# EAGLE design S7G7_footprint_simplified_w_ethernet_v1p1 (EAGLE 9.3.1)
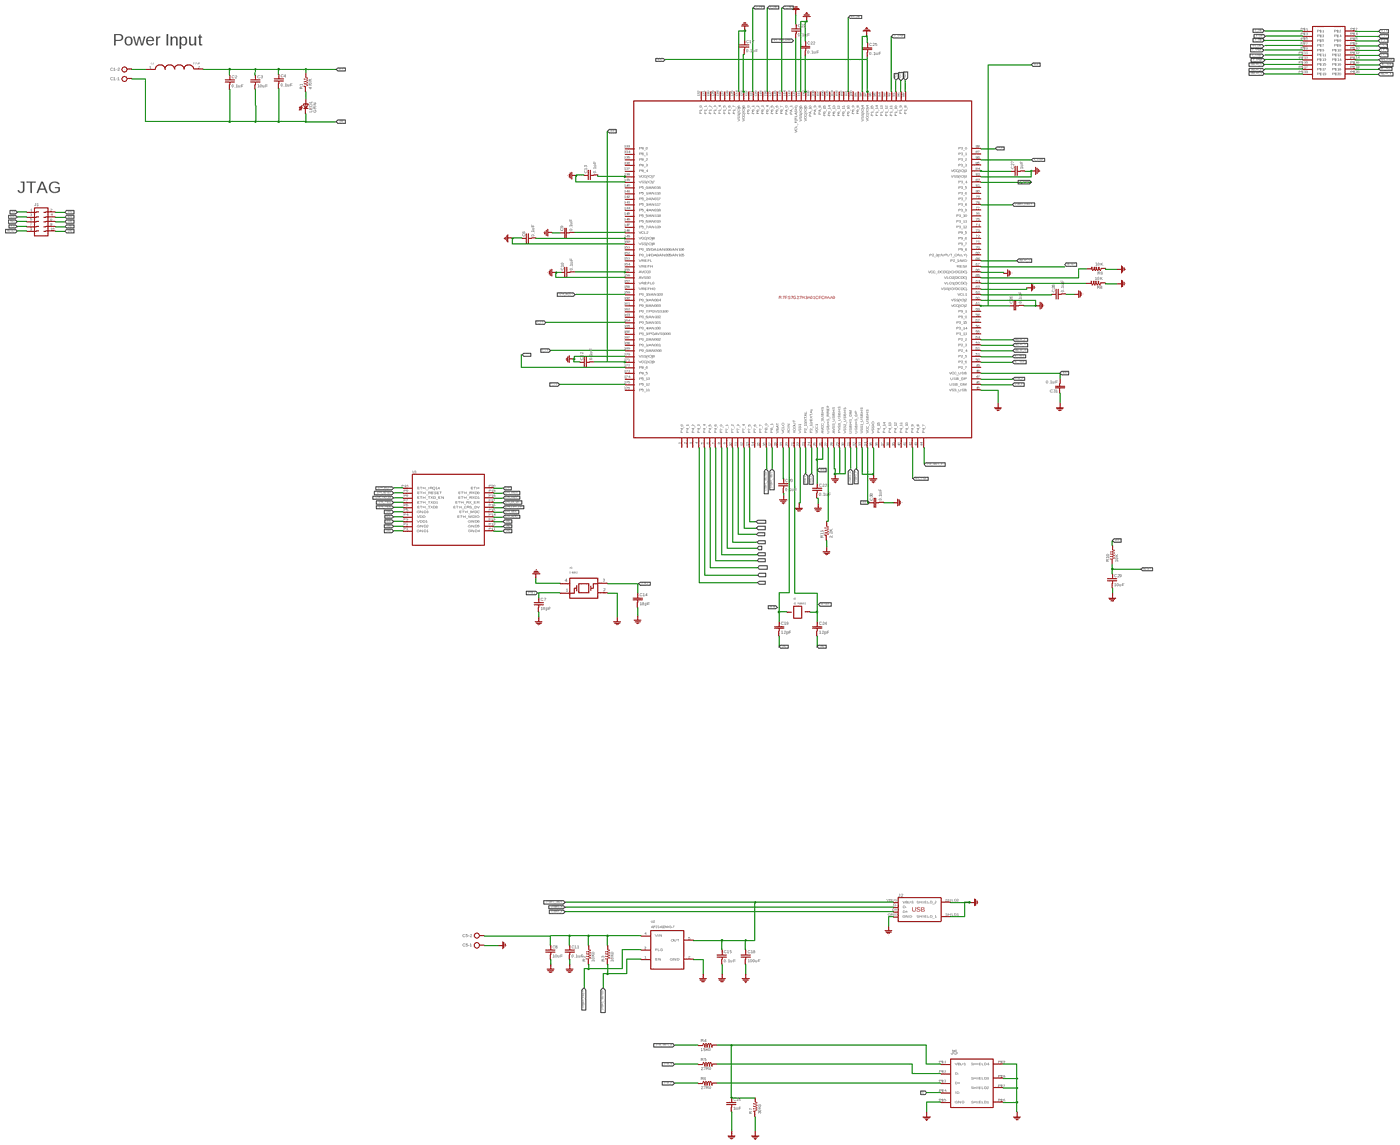
[diagram p0: schematic, sheet 1, overview]
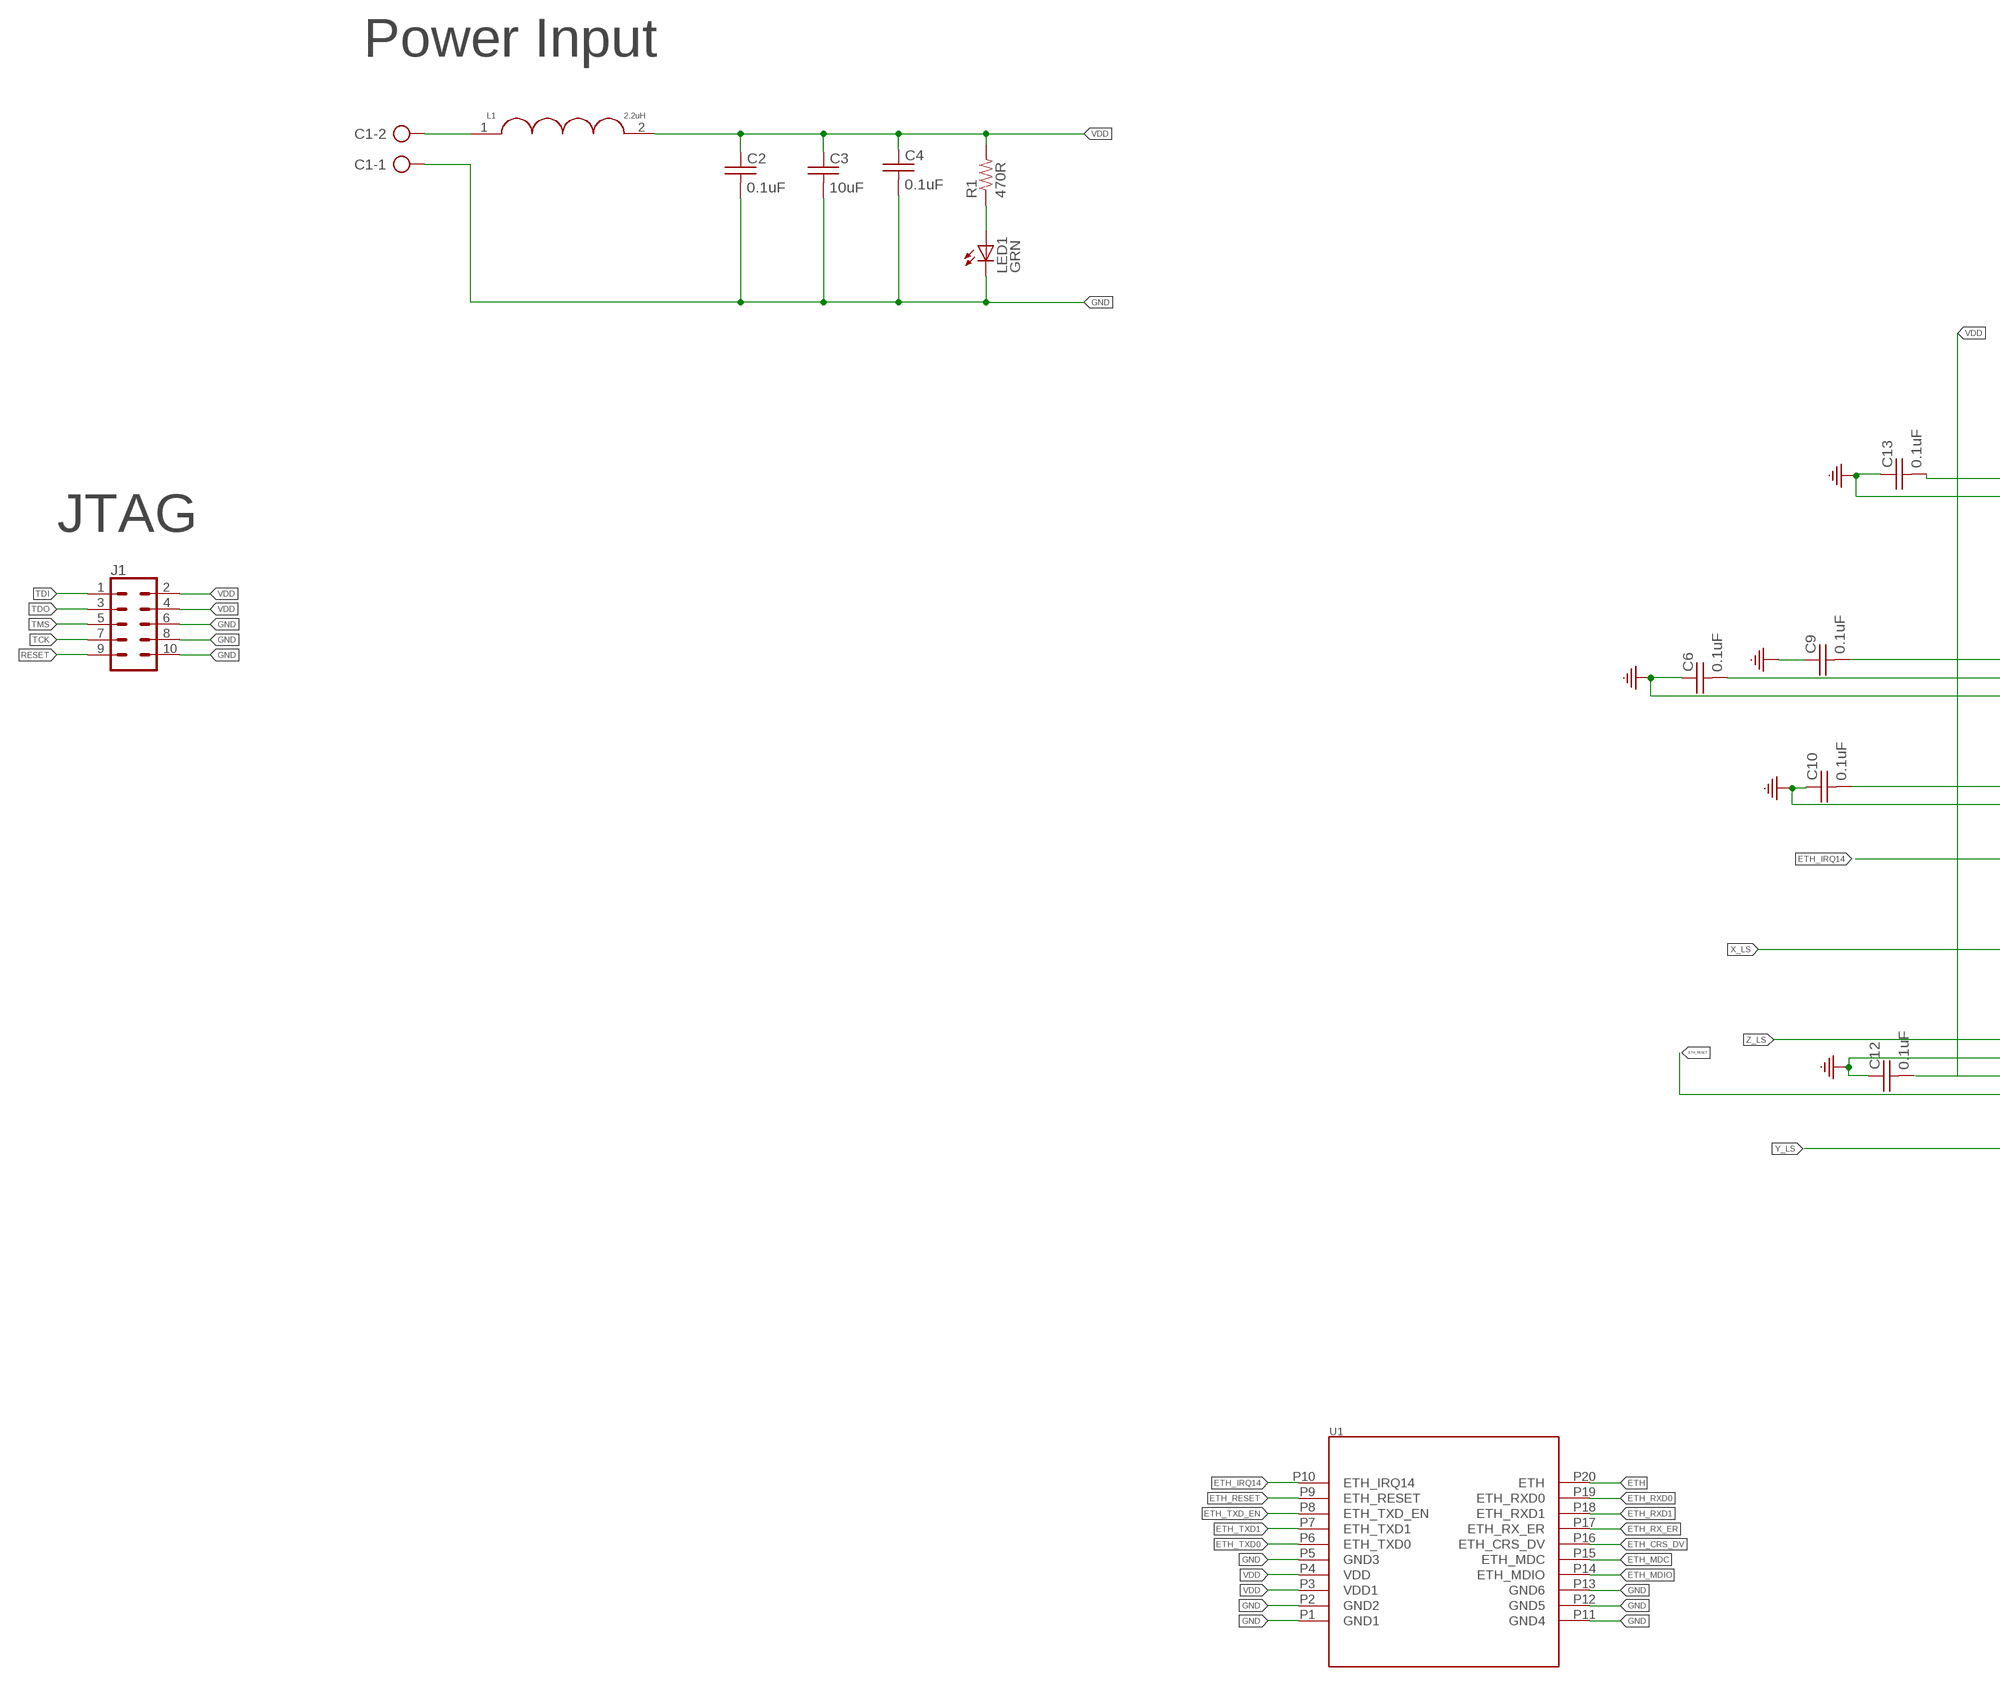
[diagram p1: schematic, sheet 1, part 1 of 4]
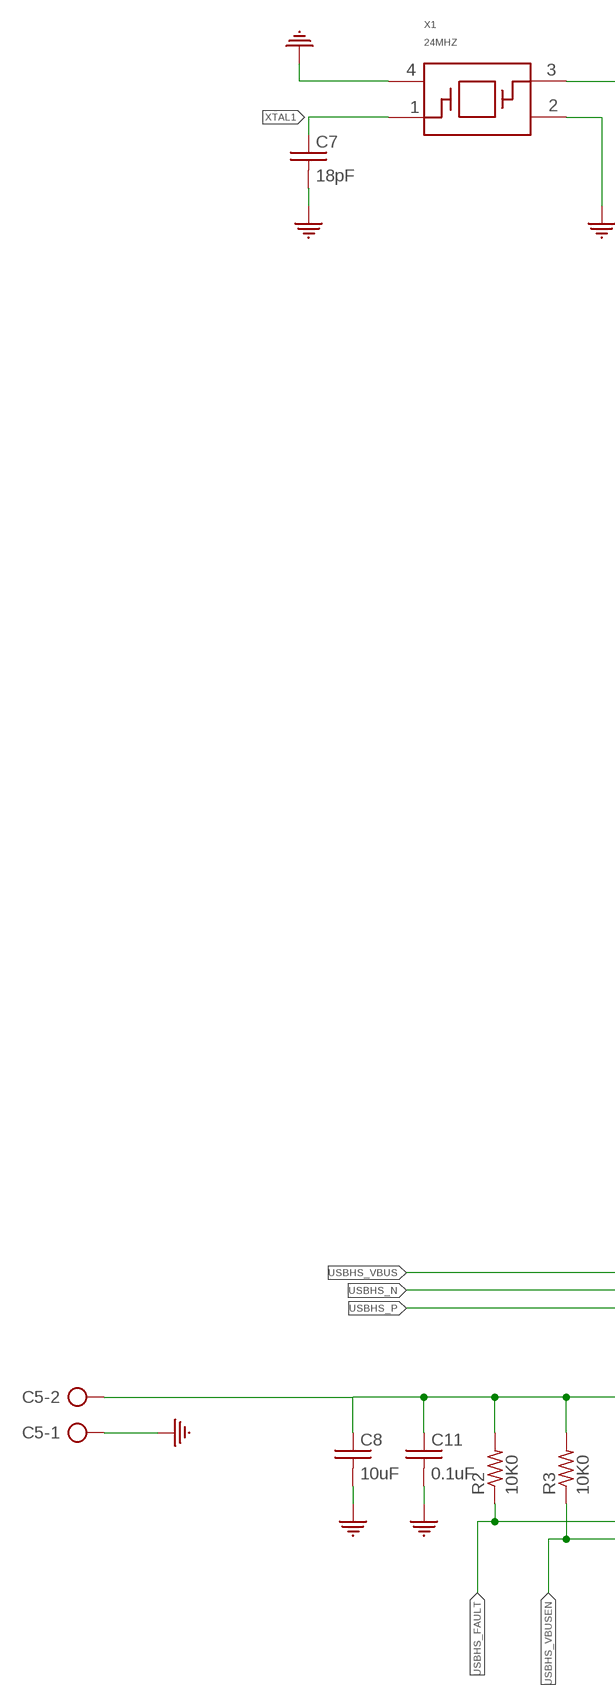
[diagram p2: schematic, sheet 1, part 2 of 4]
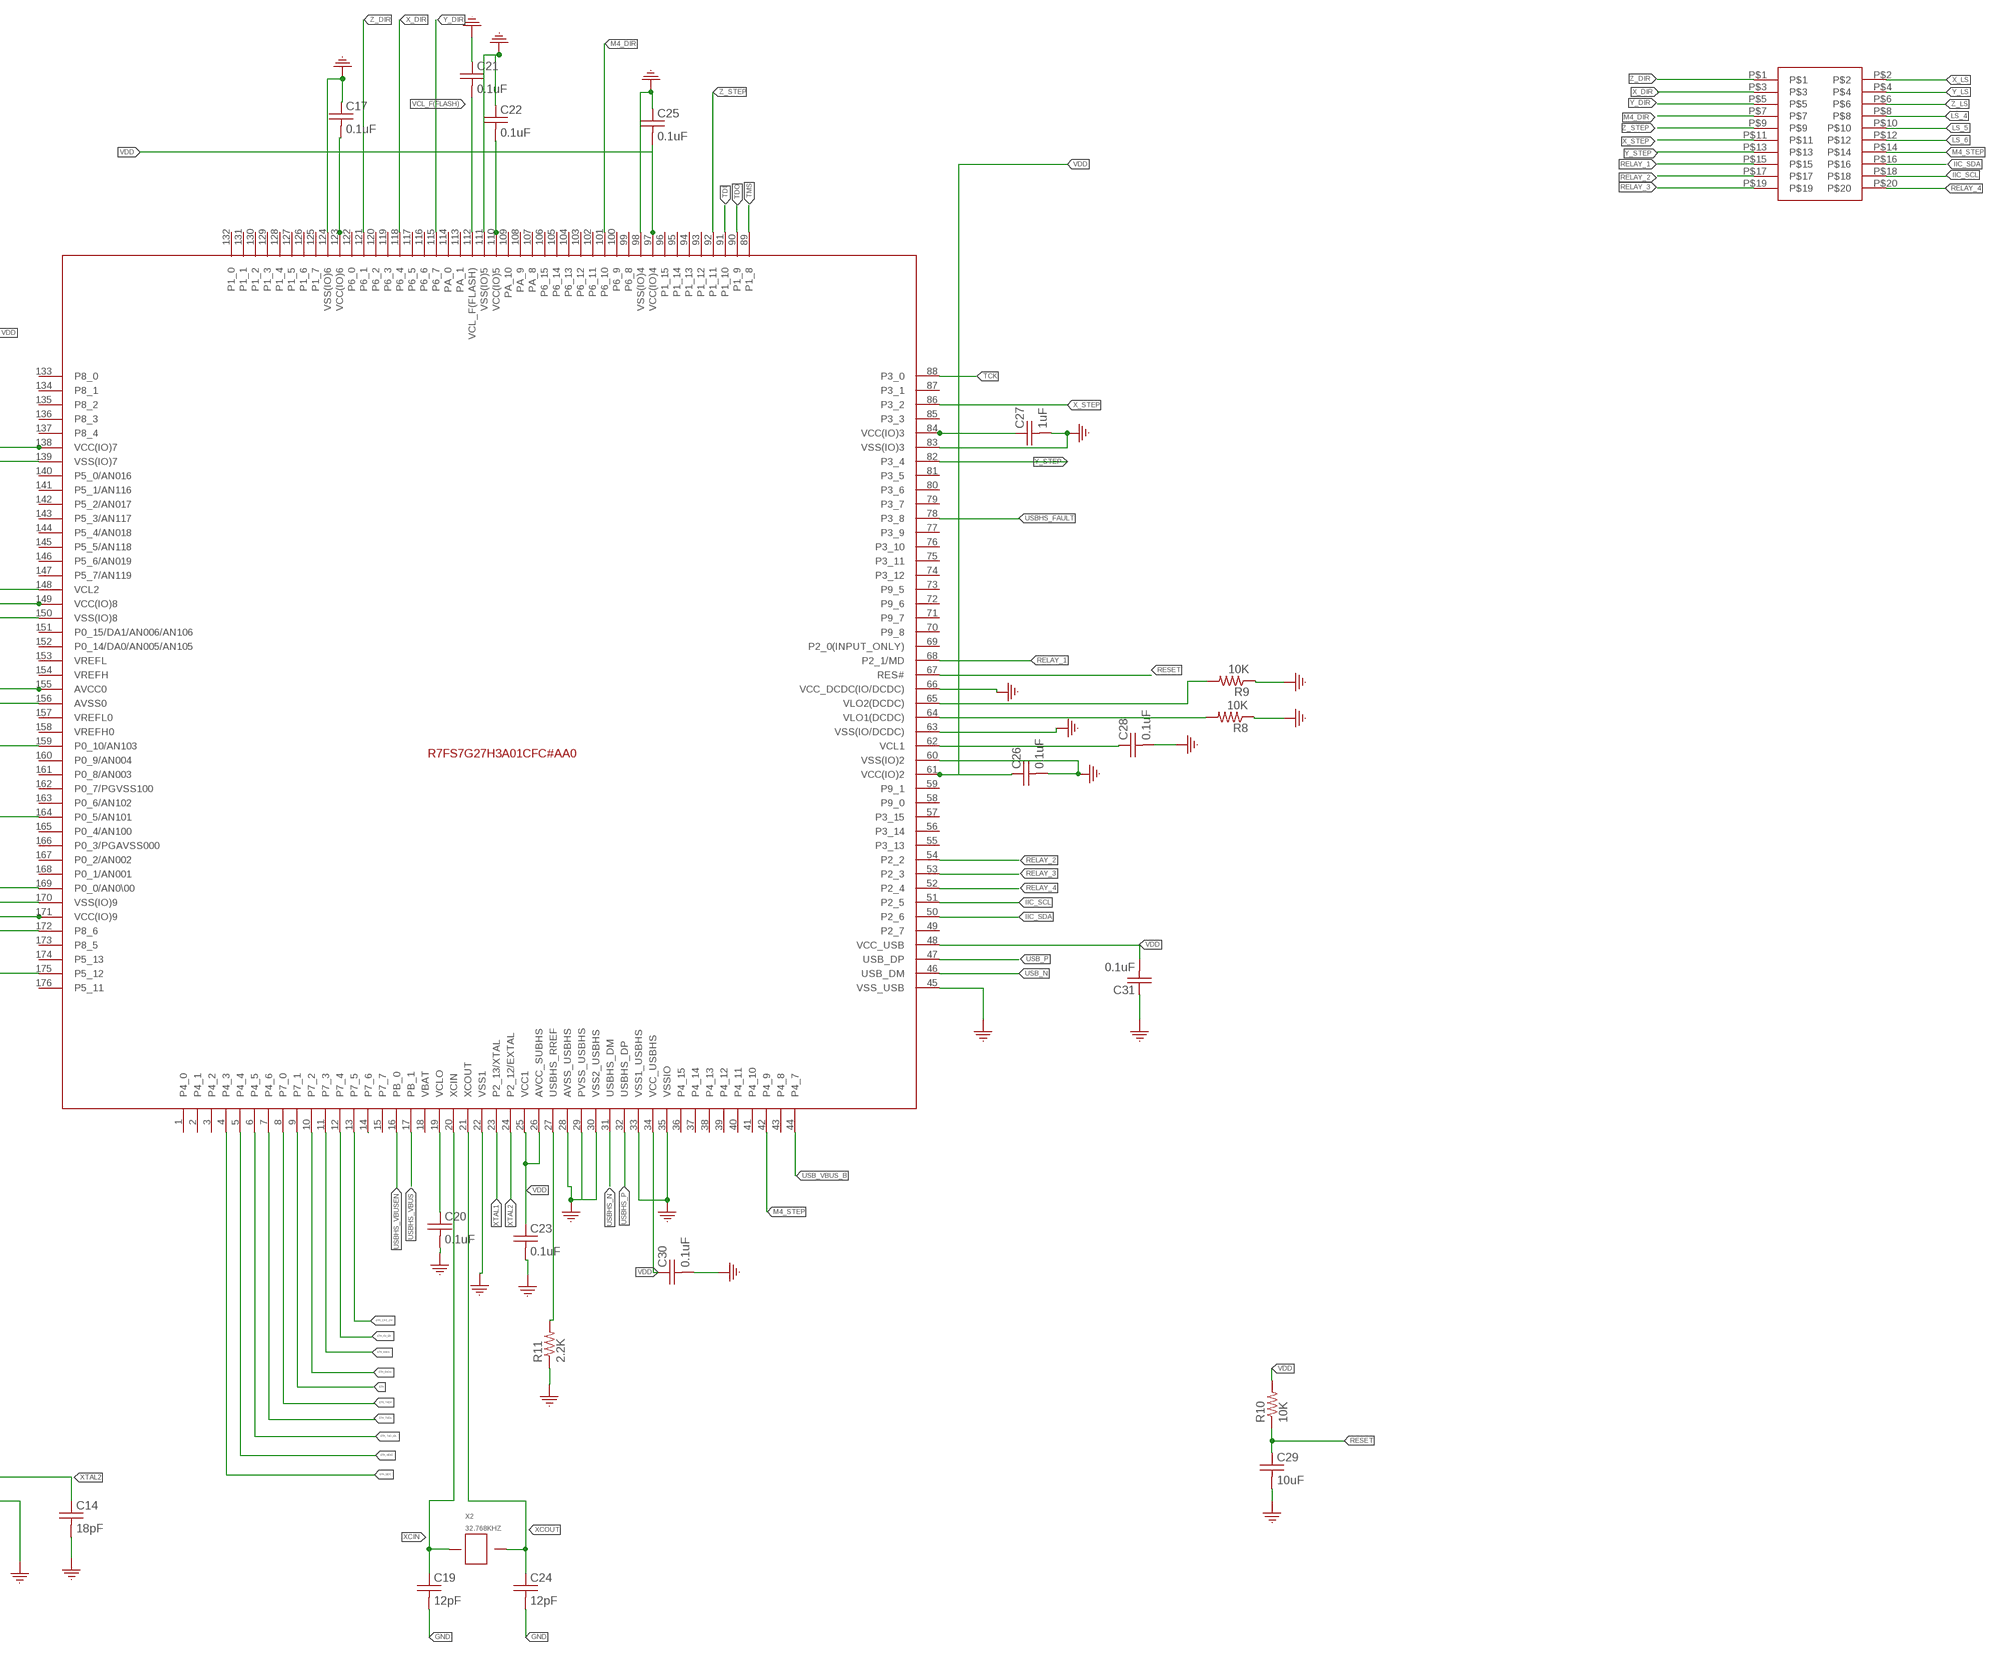
[diagram p3: schematic, sheet 1, part 3 of 4]
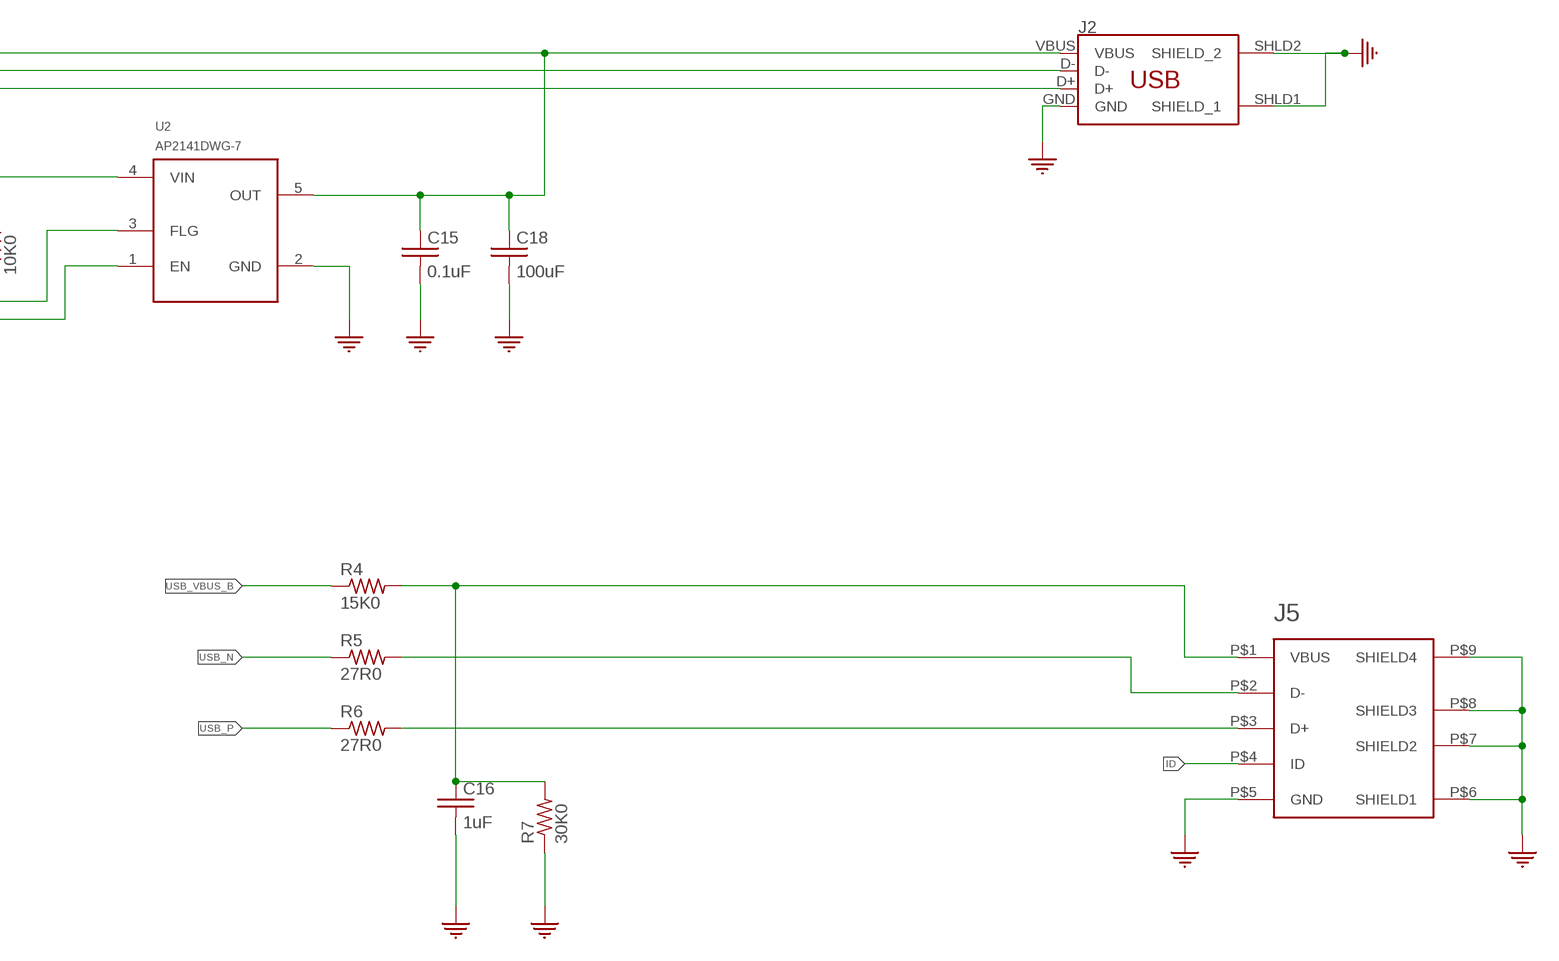
[diagram p4: schematic, sheet 1, part 4 of 4]

## Parts
C1  AK300/2  [AK300/2]
C2  0.1uF  C_0402  [0402]
C3  10uF  C_0402  [0402]
C4  0.1uF  C_0402  [0402]
C5  AK300/2  [AK300/2]
C6  0.1uF  C_0402  [0402]
C7  18pF  C_0402  [0402]
C8  10uF  C_0402  [0402]
C9  0.1uF  C_0402  [0402]
C10  0.1uF  C_0402  [0402]
C11  0.1uF  C_0402  [0402]
C12  0.1uF  C_0402  [0402]
C13  0.1uF  C_0402  [0402]
C14  18pF  C_0402  [0402]
C15  0.1uF  C_0402  [0402]
C16  1uF  C_0402  [0402]
C17  0.1uF  C_0402  [0402]
C18  100uF  C_2917  [C2917]
C19  12pF  C_0402  [0402]
C20  0.1uF  C_0402  [0402]
C21  0.1uF  C_0402  [0402]
C22  0.1uF  C_0402  [0402]
C23  0.1uF  C_0402  [0402]
C24  12pF  C_0402  [0402]
C25  0.1uF  C_0402  [0402]
C26  0.1uF  C_0402  [0402]
C27  1uF  C_0402  [0402]
C28  0.1uF  C_0402  [0402]
C29  10uF  C_0402  [0402]
C30  0.1uF  C_0402  [0402]
C31  0.1uF  C_0402  [0402]
J1  CONN_05X2PTH  [2X5]
J2  USB_A  [USB_A_SMT]
J4  2_X_10_HEADER_GENERIC  [2_X_10_.1_INCH]
J5  USB_MICRO-B  [USB_MICRO-B]
L1  2.2uH  INDUCTOR_1008_2.2_MH_1.3A  [1008_(2520_METRIC)]
LED1  LED_0805_GREEN  [LED_0805_GREEN]
R1  470R  R_0402  [0402]
R2  10K0  R_0402  [0402]
R3  10K0  R_0402  [0402]
R4  15K0  R_0402  [0402]
R5  27R0  R_0402  [0402]
R6  27R0  R_0402  [0402]
R7  30K0  R_0402  [0402]
R8  10K  R_0402  [0402]
R9  10K  R_0402  [0402]
R10  10K  R_0402  [0402]
R11  2.2K  R_0402  [0402]
U1  ETHERNET_HAT  [ETHERNET_HAT]
U2  AP2141DWG-5  [SOT-23-5]
U5  S7G2_X_176  [LQFP176_24X24]
X1  24MHZ  XTAL_24_MHZ  [SMD_3225]
X2  32.768KHZ  XTAL_32.768KHZ  [SMD_X_2_PADS]

## Nets
D+: J5.P$3(D+) R6.P$2
D-: J5.P$2(D-) R5.P$2
ETH: U1.P20(ETH) U5.9(P7_1)
ETH_CRS_DV: U1.P16(ETH_CRS_DV) U5.13(P7_5)
ETH_IRQ14: U1.P10(ETH_IRQ14) U5.159(P0_10/AN103)
ETH_MDC: U1.P15(ETH_MDC) U5.4(P4_3)
ETH_MDIO: U1.P14(ETH_MDIO) U5.5(P4_4)
ETH_RESET: U1.P9(ETH_RESET) U5.172(P8_6)
ETH_RX_ER: U1.P17(ETH_RX_ER) U5.12(P7_4)
ETH_RXD0: U1.P19(ETH_RXD0) U5.10(P7_2)
ETH_RXD1: U1.P18(ETH_RXD1) U5.11(P7_3)
ETH_TXD0: U1.P6(ETH_TXD0) U5.8(P7_0)
ETH_TXD1: U1.P7(ETH_TXD1) U5.7(P4_6)
ETH_TXD_EN: U1.P8(ETH_TXD_EN) U5.6(P4_5)
GND: C1.1 C2.P$2 C3.P$2 C4.P$2 C5.1 C6.P$1 C7.P$2 C8.P$2 C9.P$1 C10.P$1 C11.P$2 C12.P$1 C13.P$1 C14.P$2 C15.P$2 C16.P$2 C17.P$1 C18.2 C19.P$2 C20.P$2 C21.P$1 C22.P$1 C23.P$2 C24.P$2 C25.P$1 C26.P$2 C27.P$2 C28.P$2 C29.P$2 C30.P$2 C31.P$1 J1.6 J1.8 J1.10 J2.GND J2.SHLD1(SHIELD_1) J2.SHLD2(SHIELD_2) J5.P$5(GND) J5.P$6(SHIELD1) J5.P$7(SHIELD2) J5.P$8(SHIELD3) J5.P$9(SHIELD4) LED1.C R7.P$1 R8.P$1 R9.P$1 R11.P$1 U1.P1(GND1) U1.P2(GND2) U1.P5(GND3) U1.P11(GND4) U1.P12(GND5) U1.P13(GND6) U2.2(GND) U5.22(VSS1) U5.28(AVSS_USBHS) U5.29(PVSS_USBHS) U5.30(VSS2_USBHS) U5.33(VSS1_USBHS) U5.35(VSSIO) U5.45(VSS_USB) U5.60(VSS(IO)2) U5.63(VSS(IO/DCDC)) U5.66(VCC_DCDC(IO/DCDC)) U5.83(VSS(IO)3) U5.98(VSS(IO)4) U5.111(VSS(IO)5) U5.124(VSS(IO)6) U5.139(VSS(IO)7) U5.150(VSS(IO)8) U5.156(AVSS0) U5.170(VSS(IO)9) X1.2 X1.4
ID: J5.P$4(ID)
IIC_SCL: J4.P$18 U5.51(P2_5)
IIC_SDA: J4.P$16 U5.50(P2_6)
LS_4: J4.P$8
LS_5: J4.P$10
LS_6: J4.P$12
M4_DIR: J4.P$7 U5.101(P6_10)
M4_STEP: J4.P$14 U5.42(P4_9)
N$2: R11.P$2 U5.27(USBHS_RREF)
N$7: LED1.A R1.P$1
N$9: C9.P$2 U5.148(VCL2)
N$14: C20.P$1 U5.19(VCLO)
N$17: C28.P$1 U5.62(VCL1)
N$18: R8.P$2 U5.64(VLO1(DCDC))
N$19: R9.P$2 U5.65(VLO2(DCDC))
P706: U5.14(P7_6)
RELAY_1: J4.P$15 U5.68(P2_1/MD)
RELAY_2: J4.P$17 U5.54(P2_2)
RELAY_3: J4.P$19 U5.53(P2_3)
RELAY_4: J4.P$20 U5.52(P2_4)
RESET: C29.P$1 J1.9 R10.P$1 U5.67(RES#)
TCK: J1.7 U5.88(P3_0)
TDI: J1.1 U5.91(P1_10)
TDO: J1.3 U5.90(P1_9)
TMS: J1.5 U5.89(P1_8)
USB_N: R5.P$1 U5.46(USB_DM)
USB_P: R6.P$1 U5.47(USB_DP)
USB_VBUS_B: R4.P$1 U5.44(P4_7)
USBHS_FAULT: R2.P$1 U2.3(FLG) U5.78(P3_8)
USBHS_N: J2.D- U5.31(USBHS_DM)
USBHS_P: J2.D+ U5.32(USBHS_DP)
USBHS_VBUS: C15.P$1 C18.1 J2.VBUS U2.5(OUT) U5.17(PB_1)
USBHS_VBUSEN: R3.P$1 U2.1(EN) U5.16(PB_0)
VBUS: C16.P$1 J5.P$1(VBUS) R4.P$2 R7.P$2
VCL_F(FLASH): C21.P$2 U5.112(VCL_F(FLASH))
VDD: C2.P$1 C3.P$1 C4.P$1 C6.P$2 C10.P$2 C12.P$2 C13.P$2 C17.P$2 C22.P$2 C23.P$1 C25.P$2 C26.P$1 C27.P$1 C30.P$1 C31.P$2 J1.2 J1.4 L1.2 R1.P$2 R10.P$2 U1.P3(VDD1) U1.P4(VDD) U5.25(VCC1) U5.26(AVCC_SUBHS) U5.34(VCC_USBHS) U5.48(VCC_USB) U5.61(VCC(IO)2) U5.84(VCC(IO)3) U5.97(VCC(IO)4) U5.110(VCC(IO)5) U5.123(VCC(IO)6) U5.138(VCC(IO)7) U5.149(VCC(IO)8) U5.155(AVCC0) U5.171(VCC(IO)9)
VDD5: C5.2 C8.P$1 C11.P$1 R2.P$2 R3.P$2 U2.4(VIN)
VDDIN: C1.2 L1.1
X_DIR: J4.P$3 U5.118(P6_4)
X_LS: J4.P$2 U5.164(P0_5/AN101)
X_STEP: J4.P$11 U5.86(P3_2)
XCIN: C19.P$1 U5.20(XCIN) X2.P$1
XCOUT: C24.P$1 U5.21(XCOUT) X2.P$2
XTAL1: C7.P$1 U5.23(P2_13/XTAL) X1.1
XTAL2: C14.P$1 U5.24(P2_12/EXTAL) X1.3
Y_DIR: J4.P$5 U5.115(P6_7)
Y_LS: J4.P$4 U5.175(P5_12)
Y_STEP: J4.P$13 U5.82(P3_4)
Z_DIR: J4.P$1 U5.121(P6_1)
Z_LS: J4.P$6 U5.169(P0_0/AN0\00)
Z_STEP: J4.P$9 U5.92(P1_11)
Unconnected: U5.1(P4_0) U5.2(P4_1) U5.3(P4_2) U5.15(P7_7) U5.18(VBAT) U5.36(P4_15) U5.37(P4_14) U5.38(P4_13) U5.39(P4_12) U5.40(P4_11) U5.41(P4_10) U5.43(P4_8) U5.49(P2_7) U5.55(P3_13) U5.56(P3_14) U5.57(P3_15) U5.58(P9_0) U5.59(P9_1) U5.69(P2_0(INPUT_ONLY)) U5.70(P9_8) U5.71(P9_7) U5.72(P9_6) U5.73(P9_5) U5.74(P3_12) U5.75(P3_11) U5.76(P3_10) U5.77(P3_9) U5.79(P3_7) U5.80(P3_6) U5.81(P3_5) U5.85(P3_3) U5.87(P3_1) U5.93(P1_12) U5.94(P1_13) U5.95(P1_14) U5.96(P1_15) U5.99(P6_8) U5.100(P6_9) U5.102(P6_11) U5.103(P6_12) U5.104(P6_13) U5.105(P6_14) U5.106(P6_15) U5.107(PA_8) U5.108(PA_9) U5.109(PA_10) U5.113(PA_1) U5.114(PA_0) U5.116(P6_6) U5.117(P6_5) U5.119(P6_3) U5.120(P6_2) U5.122(P6_0) U5.125(P1_7) U5.126(P1_6) U5.127(P1_5) U5.128(P1_4) U5.129(P1_3) U5.130(P1_2) U5.131(P1_1) U5.132(P1_0) U5.133(P8_0) U5.134(P8_1) U5.135(P8_2) U5.136(P8_3) U5.137(P8_4) U5.140(P5_0/AN016) U5.141(P5_1/AN116) U5.142(P5_2/AN017) U5.143(P5_3/AN117) U5.144(P5_4/AN018) U5.145(P5_5/AN118) U5.146(P5_6/AN019) U5.147(P5_7/AN119) U5.151(P0_15/DA1/AN006/AN106) U5.152(P0_14/DA0/AN005/AN105) U5.153(VREFL) U5.154(VREFH) U5.157(VREFL0) U5.158(VREFH0) U5.160(P0_9/AN004) U5.161(P0_8/AN003) U5.162(P0_7/PGVSS100) U5.163(P0_6/AN102) U5.165(P0_4/AN100) U5.166(P0_3/PGAVSS000) U5.167(P0_2/AN002) U5.168(P0_1/AN001) U5.173(P8_5) U5.174(P5_13) U5.176(P5_11)

## Notes on the sheet
- Power Input
- JTAG

## Library data of the parts
C1 C5 = 3D_MIG_Controller:AK300/2: CONNECTOR; OC_FARNELL: unknown; OC_NEWARK: unknown
C2-C4 C6-C17 C19-C31 = 3D_MIG_Controller:C_0402
C18 = 3D_MIG_Controller:C_2917
J1 = 3D_MIG_Controller:CONN_05X2: Multi connection point. Often used as Generic Header-pin footprint for 0.1 inch spaced/style header connections For AVR SPI programming port, see special device with nice symbol: "AVR_SPI_PROG_5x2.dev" You can populate with any combo of single row headers, but if you'd like an exact match, check these: 2x5 AVR ICSP Male Header <https://www.sparkfun.com/products/778> (PRT-00778) 2x5 Pin Shrouded Header <https://www.sparkfun.com/products/8506> (PRT-08506) On any of the 0.1 inch spaced packages, you can populate with these: Break Away Headers - Straight <https://www.sparkfun.com/products/116> (PRT-00116) Break Away Male Headers - Right Angle <https://www.sparkfun.com/products/553> (PRT-00553) Female Headers <https://www.sparkfun.com/products/115> (PRT-00115) Break Away Headers - Machine Pin <https://www.sparkfun.com/products/117> (PRT-00117) Break Away Female Headers - Swiss Machine Pin <https://www.sparkfun.com/products/743> (PRT-00743) Special note: the shrouded connector mates well with our 5x2 ribbon cables: 2x5 Pin IDC Ribbon Cable <https://www.sparkfun.com/products/8535> (PRT-08535); PROD_ID: CONN-08499; SF_ID: PRT-0778
J2 = 3D_MIG_Controller:USB_A: USB-A Connector Male and female variants, as well as PTH and SMT variants SparkFun Products: SparkFun XBee Explorer Dongle <https://www.sparkfun.com/products/11697> PTH Male SparkFun MicroView-USB Programmer <https://www.sparkfun.com/products/12924> SMT Male SparkFun USB Type A Female Breakout <https://www.sparkfun.com/products/12700> SMT Female
J4 = 3D_MIG_Controller:2_X_10_HEADER_GENERIC
J5 = 3D_MIG_Controller:USB_MICRO-B
L1 = 3D_MIG_Controller:INDUCTOR_1008_2.2_MH_1.3A
LED1 = 3D_MIG_Controller:LED_0805_GREEN
R1-R11 = 3D_MIG_Controller:R_0402
U1 = 3D_MIG_Controller:ETHERNET_HAT
U2 = 3D_MIG_Controller:AP2141DWG-5
U5 = 3D_MIG_Controller:S7G2_X_176
X1 = 3D_MIG_Controller:XTAL_24_MHZ
X2 = 3D_MIG_Controller:XTAL_32.768KHZ

## Board
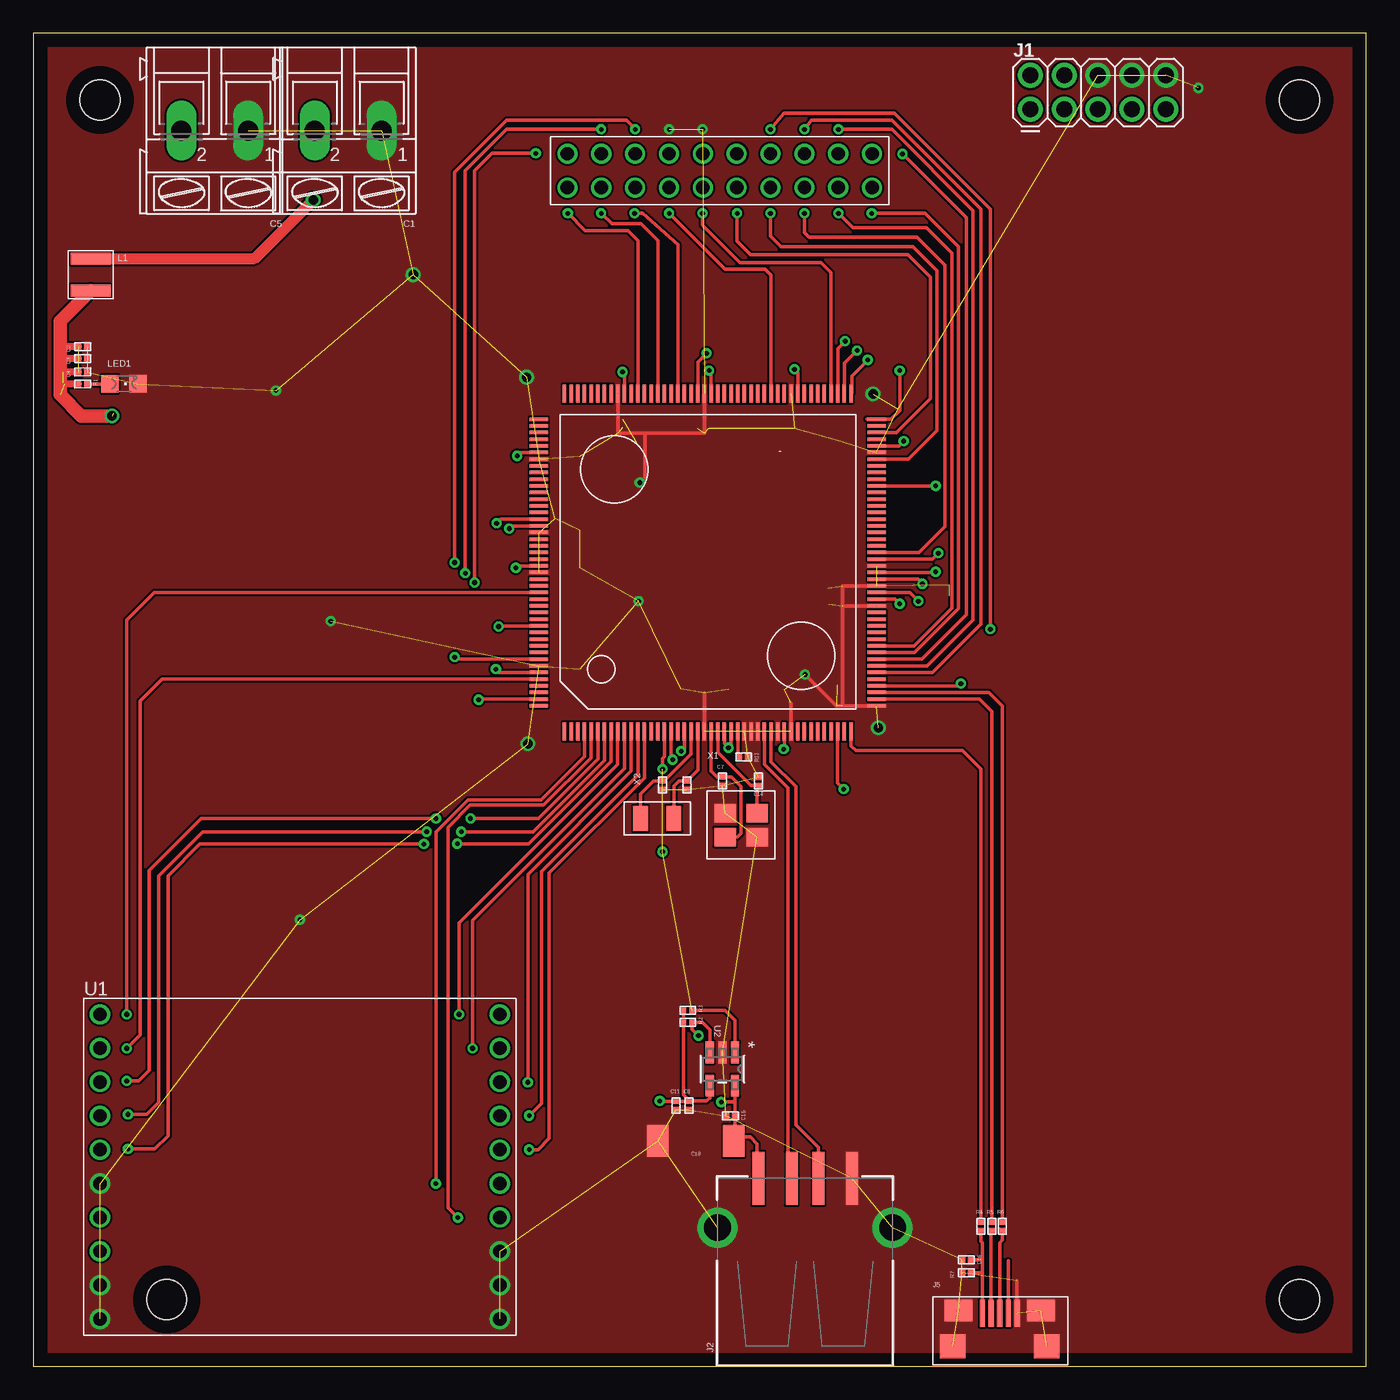
[diagram p5: board, top side]
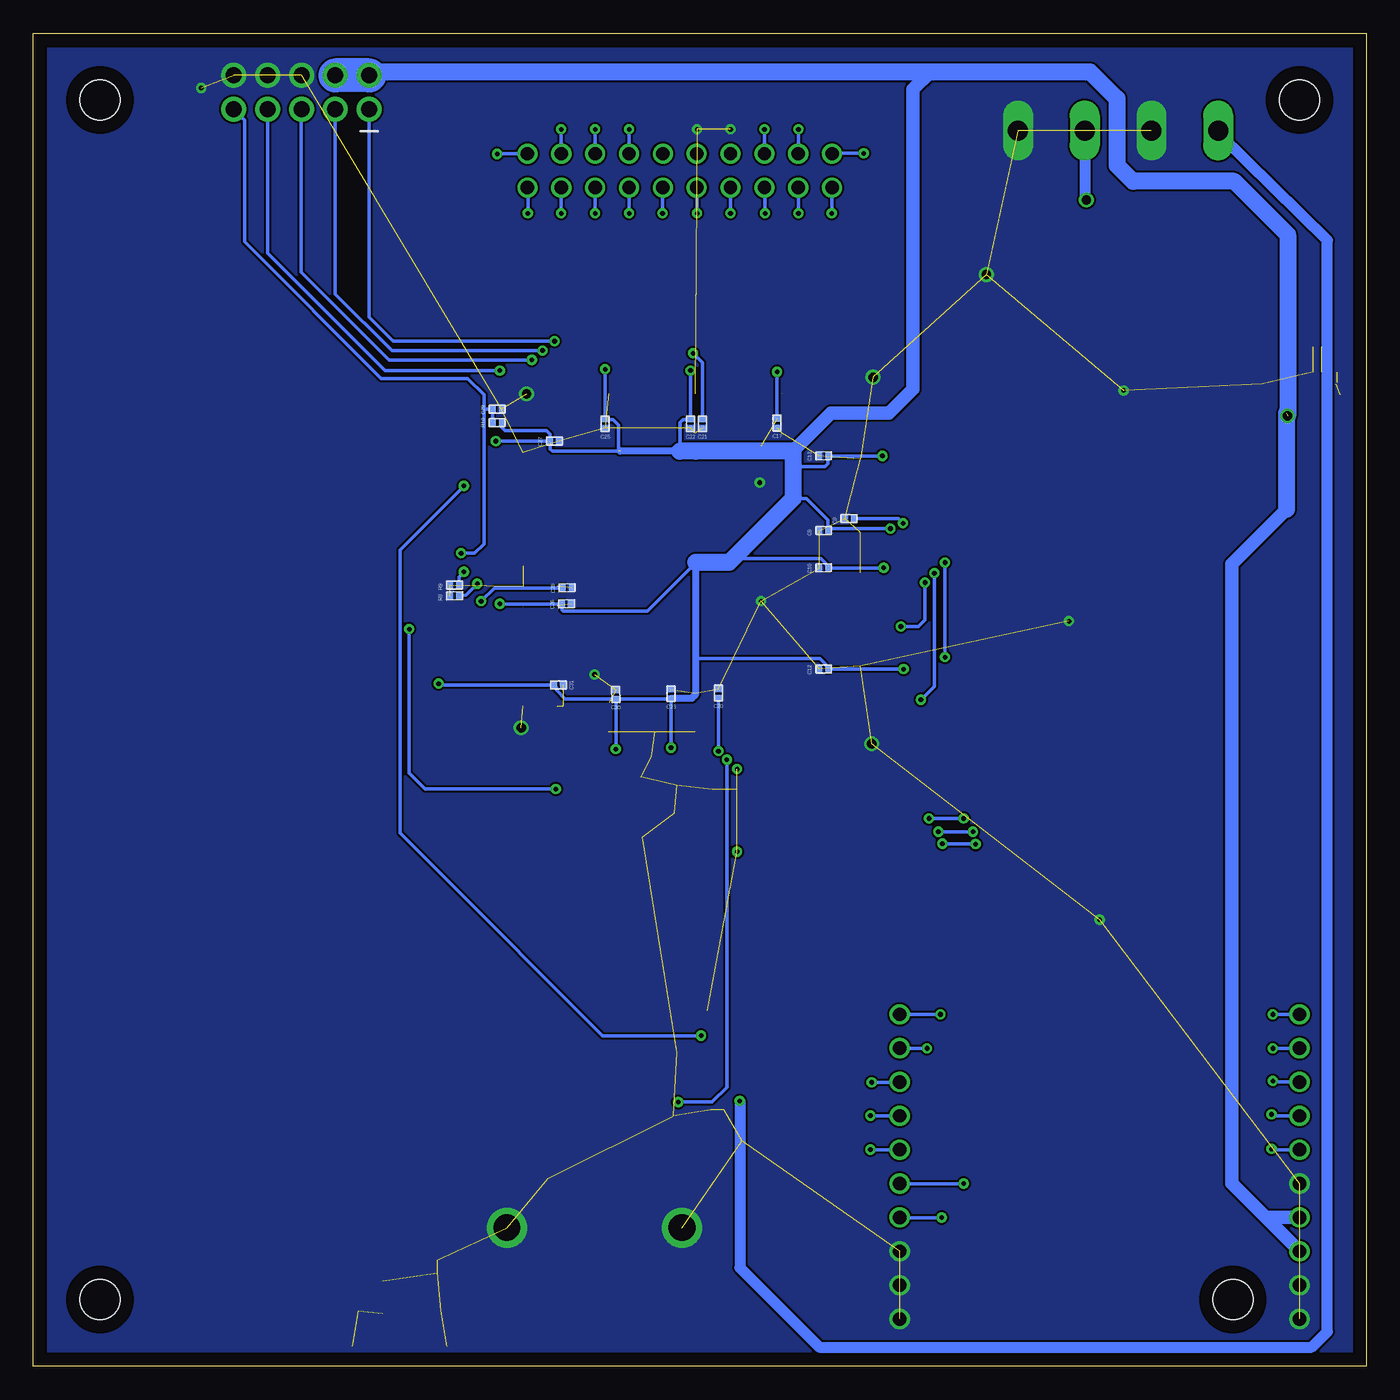
[diagram p6: board, bottom side, seen from below]

Size 100 x 100 mm. Coordinates in mm from the lower left corner, seen from the top.
Outline: 0,0 100,0 100,100 0,100 0,0
Copper layers (1*16): Top 0.035mm / dielectric 1.5mm / Bottom 0.035mm
Design rules "default": minimum track width 6mil, minimum drill 0.35mm, track to track 6mil, track to pad 6mil, pad to pad 6mil, via to via 6mil, smd to smd 6mil, copper to edge 40mil, drill to drill 6mil, minimum pad ring 10mil, minimum via ring 8mil, stop-mask expansion 4mil, vias tented up to drill 0mil, thermal gap 10mil
Holes 3 mm at 5,95 95,95 95,5 10,5

### Footprints (pad centres in the part's own frame; a part is rotated, then mirrored left to right if it is on the bottom)
AK300/2 = drill 1.5 long: 1 -2.515,0; 2 2.489,0
0402 = smd 0.5 x 0.4: P$1 0,0.325; P$2 0,-0.325
C2917 = smd 1.6 x 2.4: 1 -2.85,0; 2 2.85,0
2X5 = drill 1.2 pad 1.88: 1 0,0; 2 0,2.54; 3 2.54,0; 4 2.54,2.54; 5 5.08,0; 6 5.08,2.54; 7 7.62,0; 8 7.62,2.54; 9 10.16,0; 10 10.16,2.54
USB_A_SMT = smd 4 x 0.9: D+ 6.7,-1; D- 6.7,1; GND 6.7,-3.5; VBUS 6.7,3.5 | drill 2: SHLD1 3,-6.566; SHLD2 3,6.566
2_X_10_.1_INCH = drill 1: P$1 -11.43,-1.27; P$2 -11.43,1.27; P$3 -8.89,-1.27; P$4 -8.89,1.27; P$5 -6.35,-1.27; P$6 -6.35,1.27; P$7 -3.81,-1.27; P$8 -3.81,1.27; P$9 -1.27,-1.27; P$10 -1.27,1.27; P$11 1.27,-1.27; P$12 1.27,1.27; P$13 3.81,-1.27; P$14 3.81,1.27; P$15 6.35,-1.27; P$16 6.35,1.27; P$17 8.89,-1.27; P$18 8.89,1.27; P$19 11.43,-1.27; P$20 11.43,1.27
USB_MICRO-B = smd 0.4 x 2: P$1 -1.3,2.475; P$2 -0.65,2.475; P$3 0,2.475; P$4 0.65,2.475; P$5 1.3,2.475 | smd 2.1 x 1.6: P$6 -3.1,2.675; P$7 3.1,2.675 | smd 1.9 x 1.8: P$8 -3.525,0; P$9 3.525,0
1008_(2520_METRIC) = smd 3 x 0.9: 1 0,1.2; 2 0,-1.2
LED_0805_GREEN = smd 1.3 x 1.3: A 0,-1.05; C 0,1.05
ETHERNET_HAT = drill 1: P1 -15.3,-10.96; P2 -15.3,-8.42; P3 -15.3,-5.88; P4 -15.3,-3.34; P5 -15.3,-0.8; P6 -15.3,1.74; P7 -15.3,4.28; P8 -15.3,6.82; P9 -15.3,9.36; P10 -15.3,11.9; P11 14.7,-10.96; P12 14.7,-8.42; P13 14.7,-5.88; P14 14.7,-3.34; P15 14.7,-0.8; P16 14.7,1.74; P17 14.7,4.28; P18 14.7,6.82; P19 14.7,9.36; P20 14.7,11.9
SOT-23-5 = smd 1.626 x 0.61: 1 -1.245,0.95; 2 -1.245,0; 3 -1.245,-0.95; 4 1.245,-0.95; 5 1.245,0.95
LQFP176_24X24 = smd 1.372 x 0.254: 1 -12.675,10.75; 2 -12.675,10.25; 3 -12.675,9.75; 4 -12.675,9.25; 5 -12.675,8.75; 6 -12.675,8.25; 7 -12.675,7.75; 8 -12.675,7.25; 9 -12.675,6.75; 10 -12.675,6.25; 11 -12.675,5.75; 12 -12.675,5.25; 13 -12.675,4.75; 14 -12.675,4.25; 15 -12.675,3.75; 16 -12.675,3.25; 17 -12.675,2.75; 18 -12.675,2.25; 19 -12.675,1.75; 20 -12.675,1.25; 21 -12.675,0.75; 22 -12.675,0.25; 23 -12.675,-0.25; 24 -12.675,-0.75; 25 -12.675,-1.25; 26 -12.675,-1.75; 27 -12.675,-2.25; 28 -12.675,-2.75; 29 -12.675,-3.25; 30 -12.675,-3.75; 31 -12.675,-4.25; 32 -12.675,-4.75; 33 -12.675,-5.25; 34 -12.675,-5.75; 35 -12.675,-6.25; 36 -12.675,-6.75; 37 -12.675,-7.25; 38 -12.675,-7.75; 39 -12.675,-8.25; 40 -12.675,-8.75; 41 -12.675,-9.25; 42 -12.675,-9.75; 43 -12.675,-10.25; 44 -12.675,-10.75; 89 12.675,-10.75; 90 12.675,-10.25; 91 12.675,-9.75; 92 12.675,-9.25; 93 12.675,-8.75; 94 12.675,-8.25; 95 12.675,-7.75; 96 12.675,-7.25; 97 12.675,-6.75; 98 12.675,-6.25; 99 12.675,-5.75; 100 12.675,-5.25; 101 12.675,-4.75; 102 12.675,-4.25; 103 12.675,-3.75; 104 12.675,-3.25; 105 12.675,-2.75; 106 12.675,-2.25; 107 12.675,-1.75; 108 12.675,-1.25; 109 12.675,-0.75; 110 12.675,-0.25; 111 12.675,0.25; 112 12.675,0.75; 113 12.675,1.25; 114 12.675,1.75; 115 12.675,2.25; 116 12.675,2.75; 117 12.675,3.25; 118 12.675,3.75; 119 12.675,4.25; 120 12.675,4.75; 121 12.675,5.25; 122 12.675,5.75; 123 12.675,6.25; 124 12.675,6.75; 125 12.675,7.25; 126 12.675,7.75; 127 12.675,8.25; 128 12.675,8.75; 129 12.675,9.25; 130 12.675,9.75; 131 12.675,10.25; 132 12.675,10.75 | smd 0.254 x 1.372: 45 -10.75,-12.675; 46 -10.25,-12.675; 47 -9.75,-12.675; 48 -9.25,-12.675; 49 -8.75,-12.675; 50 -8.25,-12.675; 51 -7.75,-12.675; 52 -7.25,-12.675; 53 -6.75,-12.675; 54 -6.25,-12.675; 55 -5.75,-12.675; 56 -5.25,-12.675; 57 -4.75,-12.675; 58 -4.25,-12.675; 59 -3.75,-12.675; 60 -3.25,-12.675; 61 -2.75,-12.675; 62 -2.25,-12.675; 63 -1.75,-12.675; 64 -1.25,-12.675; 65 -0.75,-12.675; 66 -0.25,-12.675; 67 0.25,-12.675; 68 0.75,-12.675; 69 1.25,-12.675; 70 1.75,-12.675; 71 2.25,-12.675; 72 2.75,-12.675; 73 3.25,-12.675; 74 3.75,-12.675; 75 4.25,-12.675; 76 4.75,-12.675; 77 5.25,-12.675; 78 5.75,-12.675; 79 6.25,-12.675; 80 6.75,-12.675; 81 7.25,-12.675; 82 7.75,-12.675; 83 8.25,-12.675; 84 8.75,-12.675; 85 9.25,-12.675; 86 9.75,-12.675; 87 10.25,-12.675; 88 10.75,-12.675; 133 10.75,12.675; 134 10.25,12.675; 135 9.75,12.675; 136 9.25,12.675; 137 8.75,12.675; 138 8.25,12.675; 139 7.75,12.675; 140 7.25,12.675; 141 6.75,12.675; 142 6.25,12.675; 143 5.75,12.675; 144 5.25,12.675; 145 4.75,12.675; 146 4.25,12.675; 147 3.75,12.675; 148 3.25,12.675; 149 2.75,12.675; 150 2.25,12.675; 151 1.75,12.675; 152 1.25,12.675; 153 0.75,12.675; 154 0.25,12.675; 155 -0.25,12.675; 156 -0.75,12.675; 157 -1.25,12.675; 158 -1.75,12.675; 159 -2.25,12.675; 160 -2.75,12.675; 161 -3.25,12.675; 162 -3.75,12.675; 163 -4.25,12.675; 164 -4.75,12.675; 165 -5.25,12.675; 166 -5.75,12.675; 167 -6.25,12.675; 168 -6.75,12.675; 169 -7.25,12.675; 170 -7.75,12.675; 171 -8.25,12.675; 172 -8.75,12.675; 173 -9.25,12.675; 174 -9.75,12.675; 175 -10.25,12.675; 176 -10.75,12.675
SMD_3225 = smd 1.6 x 1.4: 1 -1.2,-0.9; 2 1.2,-0.9; 3 1.2,0.9; 4 -1.2,0.9
SMD_X_2_PADS = smd 1.9 x 1.1: P$1 0,1.25; P$2 0,-1.25

### Placement (x,y rotation side)
C1  23.6,92.7 180 top
C2  3.7,76.5 90 top
C3  3.7,75.6 90 top
C4  3.7,74.6 90 top
C5  13.6,92.7 180 top
C6  40.7,62.7 90 bottom
C7  51.7,43.9 0 top
C8  49.2,19.55 0 top
C9  38.8,63.6 90 bottom
C10  40.7,59.9 90 bottom
C11  48.2,19.55 0 top
C12  40.7,52.3 90 bottom
C13  40.7,68.3 90 bottom
C14  54.4,43.9 180 top
C15  52.3,18.8 270 top
C16  70,8 270 top
C17  44.2,70.75 180 bottom
C18  49.7,16.9 180 top
C19  47.2,43.6 0 top
C20  48.6,50.5 180 bottom
C21  49.8,70.7 180 bottom
C22  50.7,70.7 180 bottom
C23  52.15,50.45 180 bottom
C24  49.05,43.6 0 top
C25  57.1,70.7 180 bottom
C26  60,57.2 90 bottom
C27  60.9,69.4 90 bottom
C28  59.95,58.4 90 bottom
C29  65.2,71.8 90 bottom
C30  56.3,50.4 180 bottom
C31  60.6,51.1 270 bottom
J1  74.8,94.3 0 top
J2  57.9,7.4 90 top
J4  51.5,89.7 0 top
J5  72.5,1.5 0 top
L1  4.3,81.9 0 top
LED1  6.8,73.7 270 top
R1  3.7,73.7 270 top
R2  49.1,25.8 270 top
R3  49.1,26.7 270 top
R4  71.1,10.5 0 top
R5  71.9,10.5 0 top
R6  72.7,10.5 0 top
R7  70,7 90 top
R8  68.4,57.8 90 bottom
R9  68.4,58.6 90 bottom
R10  65.2,70.8 90 bottom
R11  53.3,45.7 270 top
U1  20.3,14.5 0 top
U2  51.7,22.3 270 top
U5  50.6,60.3 90 top
X1  53.1,40.6 0 top
X2  46.8,41.1 90 top

### Tracks (layer width: path | path; a pad name or v marks a point on that pad's centre or on a via)
D+
  Top 0.254: R6.P$2 72.7,9.47 72.5,9.28 J5.P$3
D-
  Top 0.254: R5.P$2 71.85,10.12 J5.P$2
ETH  (via drill 0.35)
  Top 0.254: U5.9 43.85,45.15 31.94,33.24 v31.94,26.4
  Bottom 0.254: v31.94,26.4 U1.P20
ETH_CRS_DV  (via drill 0.35)
  Top 0.254: U5.13 45.85,44.15 38.7,37 38.7,17.1 37.85,16.25 v37.2,16.25
  Bottom 0.254: v37.2,16.25 U1.P16
ETH_IRQ14  (via drill 0.35)
  Top 0.254: v7,26.4 7,56 9.05,58.05 U5.159
  Bottom 0.254: U1.P10 v7,26.4
ETH_MDC  (via drill 0.35)
  Top 0.254: U5.4 41.35,45.75 38.1,42.5 32.6,42.5 30.2,40.1 v30.2,13.7
  Bottom 0.254: v30.2,13.7 U1.P15
ETH_MDIO  (via drill 0.35)
  Top 0.254: U5.5 41.85,45.65 38.29,42.09 32.77,42.09 31.11,40.43 31.11,11.89 v31.85,11.15
  Bottom 0.254: v31.85,11.15 U1.P14
ETH_RESET  (via drill 0.35)
  Top 0.254: v7,23.85 8,24.85 8,49.9 9.65,51.55 U5.172
  Bottom 0.254: v7,23.85 U1.P9
ETH_RX_ER  (via drill 0.35)
  Top 0.254: U5.12 45.35,44.35 38.13,37.13 38.13,19.73 v37.2,18.8
  Bottom 0.254: v37.2,18.8 35.02,18.8 U1.P17
ETH_RXD0  (via drill 0.35)
  Top 0.254: U5.10 44.35,44.85 32.95,33.45 v32.95,23.85
  Bottom 0.254: v32.95,23.85 U1.P19
ETH_RXD1  (via drill 0.35)
  Top 0.254: U5.11 44.85,44.65 37.1,36.9 v37.1,21.3
  Bottom 0.254: v37.1,21.3 35.02,21.3 U1.P18
ETH_TXD0  (via drill 0.35)
  Top 0.254: U5.8 43.35,45.38 37.17,39.2 v31.8,39.2 | v29.3,39.17 12.47,39.17 10.1,36.8 10.1,17.3 9.1,16.3 v7.1,16.3
  Bottom 0.254: U1.P6 7.04,16.24 v7.1,16.3 | v31.8,39.2 29.33,39.2 v29.3,39.17
ETH_TXD1  (via drill 0.35)
  Top 0.254: U5.7 42.85,45.45 37.5,40.1 v32.1,40.1 | v29.5,40.1 12.7,40.1 9.4,36.8 9.4,19.8 8.5,18.9 v7.1,18.9
  Bottom 0.254: U1.P7 6.98,18.78 v7.1,18.9 | v32.1,40.1 v29.5,40.1
ETH_TXD_EN  (via drill 0.35)
  Top 0.254: U5.6 42.35,45.55 37.9,41.1 v32.8,41.1 | v30.2,41.1 12.6,41.1 8.7,37.2 8.7,22.2 7.9,21.4 v7,21.4
  Bottom 0.254: U1.P8 6.92,21.32 v7,21.4 | v32.8,41.1 v30.2,41.1
GND  (via drill 0.35, 0.7)  (90 unrouted)
  Top 0.254: U5.124 43.85,70 45.9,70 | U5.111 50.35,70 45.9,70 | U5.22 50.35,50.5 | 60.7,57.05 U5.60 | 60.7,49.55 60.7,57.05 | U5.63 60.7,58.55 60.7,57.05 | U5.35 56.85,49.75 56.8,49.8 | J5.P$5 73.8,6.4 | U5.45 60.25,49.55 v57.9,51.9 | 45.9,70 45.9,66.7 v45.5,66.3 | 45.5,57.5 v45.4,57.4
  other vias: 63.4,47.9 28.5,81.9 63,72.95 37.1,46.7 37,74.2 22.3,55.9 47.7,92.8 50.2,92.8 87.4,95.9 20,33.5 18.2,73.2
  pour Bottom (no thermals): 0.7,99.1 99.3,99.1 99.3,0.3 0.7,0.3
  pour Top: 41.9,49.5 39.9,51.5 39.8,51.5 39.8,70.7 39.9,70.8 61.2,70.8 61.2,49.5
  pour Top (no thermals): 0.6,99 99.3,99 99.3,0.3 0.6,0.3
ID
  Top 0.254: J5.P$4 73.15,7.9
IIC_SCL  (via drill 0.35)
  Top 0.254: U5.51 67.05,52.55 70.5,56 70.5,86.7 64.4,92.8 v60.4,92.8
  Bottom 0.254: v60.4,92.8 J4.P$18
IIC_SDA  (via drill 0.35)
  Top 0.254: U5.50 67.45,52.05 71.1,55.7 71.1,86.8 64.4,93.5 58.36,93.5 v57.85,92.8
  Bottom 0.254: v57.85,92.8 J4.P$16
M4_DIR  (via drill 0.35)
  Top 0.254: U5.101 55.35,81.85 54.9,82.3 51.9,82.3 v47.7,86.5
  Bottom 0.254: v47.7,86.5 J4.P$7
M4_STEP  (via drill 0.35)
  Top 0.254: U5.42 60.35,43.75 v60.8,43.3 | v55.3,92.8 56.3,94 64.6,94 71.8,86.8 v71.8,55.3
  Bottom 0.254: v60.8,43.3 70.6,43.3 71.8,44.5 v71.8,55.3 | v55.3,92.8 J4.P$14
N$2
  Top 0.254: U5.27 52.85,45.83 R11.P$2
N$7
  Top 0.254: R1.P$1 LED1.A
N$9  (via drill 0.35)
  Top 0.254: U5.148 35.05,63.55 v34.75,63.25
  Bottom 0.254: C9.P$2 35.1,63.6 v34.75,63.25
N$14  (via drill 0.35)
  Top 0.254: U5.19 48.85,46.4 v48.6,46.15
  Bottom 0.254: v48.6,46.15 C20.P$1
N$17  (via drill 0.35)
  Top 0.254: U5.62 65.75,58.05 v66.4,57.4
  Bottom 0.254: v66.4,57.4 65.4,58.4 C28.P$1
N$18  (via drill 0.35)
  Top 0.254: U5.64 66.35,59.05 v66.7,58.7
  Bottom 0.254: v66.7,58.7 67.55,57.85 R8.P$2
N$19  (via drill 0.35)
  Top 0.254: U5.65 67.7,59.55 v67.7,59.6
  Bottom 0.254: v67.7,59.6 68.08,59.23 R9.P$2
RELAY_1  (via drill 0.35)
  Top 0.254: U5.68 66.45,61.05 68.4,63 68.4,82.6 66.3,84.7 58.2,84.7 57.85,85.05 v57.85,86.5
  Bottom 0.254: v57.85,86.5 J4.P$15
RELAY_2  (via drill 0.35)
  Top 0.254: U5.54 66.05,54.05 68.9,56.9 68.9,83.5 67,85.4 61.5,85.4 v60.4,86.5
  Bottom 0.254: v60.4,86.5 J4.P$17
RELAY_3  (via drill 0.35)
  Top 0.254: U5.53 66.12,53.54 69.4,56.83 69.4,84 66.9,86.5 v62.9,86.5
  Bottom 0.254: v62.9,86.5 62.9,88.4 J4.P$19
RELAY_4  (via drill 0.35)
  Top 0.254: U5.52 66.65,53.05 70,56.4 70,86.15 v65.2,90.95
  Bottom 0.254: v65.2,90.95 62.95,90.95 J4.P$20
RESET  (via drill 0.35)
  Top 0.254: U5.67 67.45,60.55 v67.9,61
  Bottom 0.254: v67.9,61 66.9,61 66.2,61.7 66.2,71.8 | 66.2,71.8 66.2,72.9 67.4,74.1 73.9,74.1 84.16,84.36 84.16,93.5 J1.9 | R10.P$1 C29.P$1 66.2,71.8
TCK  (via drill 0.35)
  Top 0.254: 62.55,71.05 U5.88 64.35,71.05 65,71.7 v65,74.7
  Bottom 0.254: J1.7 82.42,83.5 73.62,74.7 v65,74.7
TDI  (via drill 0.35)
  Top 0.254: U5.91 60.35,76.35 v60.9,76.9
  Bottom 0.254: v60.9,76.9 73,76.9 74.8,78.7 J1.1
TDO  (via drill 0.35)
  Top 0.254: U5.90 60.85,75.25 v61.8,76.2
  Bottom 0.254: J1.3 77.34,80.44 73.1,76.2 v61.8,76.2
TMS  (via drill 0.35)
  Top 0.254: U5.89 61.4,73.03 61.4,74.3 v62.6,75.5
  Bottom 0.254: J1.5 79.9,94.28 79.9,82.1 73.3,75.5 v62.6,75.5
USB_N
  Top 0.254: U5.46 70.97,50.05 71.9,49.12 R5.P$1
USB_P
  Top 0.254: U5.47 71.7,50.55 72.7,49.55 72.7,48.5 R6.P$1 72.8,10.93
USB_VBUS_B
  Top 0.254: R4.P$1 71.1,44.8 69.7,46.2 61.7,46.2 61.35,46.55 U5.44
USBHS_FAULT  (via drill 0.35)
  Top 0.254: v67.7,66.05 U5.78 | U2.3 50.75,25.25 50.2,25.8 R2.P$1 49.42,25.27 v49.9,24.8
  Bottom 0.254: v67.7,66.05 72.5,61.25 72.5,40 63.65,31.15 63.48,30.98 57.3,24.8 v49.9,24.8
USBHS_N
  Top 0.152: 56.6,14.91 J2.D-
  Top 0.254: U5.31 54.85,45.15 56.6,43.4 56.6,14.91
USBHS_P
  Top 0.254: U5.32 55.35,45.35 57.2,43.5 57.2,18.11 58.9,16.41 J2.D+
USBHS_VBUS  (via drill 0.35)
  Top 0.254: U5.17 47.85,45.62 v47.97,45.5 | U2.5 52.65,20 | 52.65,20 52.65,19.37 52.65,18.83 C15.P$1 52.62,17.2 | 52.62,17.2 52.62,16.98 C18.1 | 54.4,15.05 J2.VBUS 54.3,14.71 54.3,16.7 53.8,17.2 52.62,17.2 | v51.62,19.82 52.47,19.82 52.65,20
  Bottom 0.254: v47.97,45.5 47.97,20.93 49.09,19.82 v51.62,19.82
USBHS_VBUSEN  (via drill 0.35)  (2 unrouted)
  Top 0.254: v47.2,44.8 47.2,45.6 47.35,45.75 U5.16 | R3.P$1 51.9,26.7 52.65,25.95 U2.1
  other vias: 47.2,38.6
VBUS
  Top 0.254: J5.P$1 71.2,7 | 71.2,7 71.2,8 | R4.P$2 71.1,9.38 71.2,9.28 71.2,8 | R7.P$2 71.2,7 | C16.P$1 71.2,8
VCL_F(FLASH)  (via drill 0.35)
  Top 0.254: U5.112 49.85,75.35 v50.5,76
  Bottom 0.254: C21.P$2 49.8,75.3 v50.5,76
VDD  (via drill 0.35, 0.7)  (7 unrouted)
  Top 0.254: U5.97 57.35,74.55 v57.1,74.8 | U5.110 50.85,74.55 v50.7,74.7 | U5.149 35.9,63.05 v35.7,62.85 | U5.138 36.55,68.55 v36.3,68.3 | U5.171 34.95,52.05 v34.7,52.3 | U5.155 36.35,60.05 v36.2,59.9 | U5.25 51.85,46.71 v52.16,46.4 52.35,46.59 U5.26 | U5.61 64.65,57.55 v65,57.2 | U5.123 44.35,74.45 v44.2,74.6 | U5.84 64.95,69.05 v65.3,69.4 | U5.34 56.35,46.35 v56.3,46.3 | U5.48 69.44,51.05 v69.6,51.21
  Top 0.508: R1.P$2 2.3,73.7 2.2,73.8 | C4.P$1 2.2,74.6 | C3.P$1 2.2,75.6 | C2.P$1 2,76.5
  Top 1.016: L1.2 2,78.4 2,72.9 3.6,71.3 v5.9,71.3
  Bottom 0.254: v35.7,62.85 40.23,62.85 C6.P$2 40.38,63.48 42,65.1 43,65.1 | v36.2,59.9 C10.P$2 40.58,60.27 40.9,60.6 47.5,60.6 47.8,60.3 | v65,57.2 C26.P$1 60.33,56.73 60.27,56.67 53.93,56.67 50.3,60.3 | v65.3,69.4 C27.P$1 | v57.1,74.8 C25.P$2 56.52,71.03 56.1,70.6 56.1,68.65 61.05,68.65 61.23,68.83 C27.P$1 | v34.7,52.3 C12.P$2 40.62,52.73 41,53.1 50.3,53.1 | v52.16,46.4 C23.P$1 52.2,50.08 C30.P$1 | v36.3,68.3 C13.P$2 40.38,67.72 40.6,67.5 43,67.5 | C17.P$2 v44.2,74.6 | v50.7,74.7 C22.P$2 51.27,71.03 51.5,70.8 51.5,68.65 | C27.P$1 61.23,69.92 61.5,70.2 64.6,70.2 64.88,70.47 R10.P$2 | v56.3,46.3 C30.P$1 | v69.6,51.21 69.49,51.1 C31.P$2 60.75,50.93 60.75,50.73 60.09,50.08 C30.P$1
  Bottom 0.508: 43,68.65 45,68.65 | 45,68.65 50.3,68.65 | 45.4,69.05 45,68.65 | 50.3,60.3 50.3,53.1 50.3,50.4 50.58,50.12 C23.P$1 | 51.5,68.65 55.95,68.65
  Bottom 0.813: 74.54,97.1 J1.2
  Bottom 1.016: 5.99,64.29 10.09,60.19 10.09,13.71 U1.P3 7.54,11.16 U1.P4 | 43,68.65 40.15,71.5 35.8,71.5 34,73.3 34,95.8 32.7,97.1
  Bottom 1.27: 5.99,71.5 5.99,64.29 | 51.5,68.65 50.3,68.65 43,68.65 43,67.5 43,65.1 47.8,60.3 50.3,60.3 | 74.54,97.1 32.7,97.1 20.7,97.1 18.7,95.1 18.7,90.1 17.5,88.9 9.9,88.9 5.9,84.9 v5.9,71.3
  Bottom 2.54: J1.2 J1.4
VDD5  (via drill 0.35)
  Top 0.254: U2.4 50.75,20.15 50.5,19.9 49.23,19.9 | 49.23,19.9 C8.P$1 C11.P$1 47.02,19.88 v47,19.9 | R3.P$2 R2.P$2 48.77,20.35 49.23,19.9
  Bottom 0.813: 11.11,92.5 2.91,84.47 2.91,2.6 4.09,1.42 41.02,1.42 47,7.4 v47,19.9
  Bottom 1.016: C5.2 11.11,92.5
VDDIN  (via drill 0.7)
  Top 0.813: v21,87.5 16.6,83.1 L1.1
  Bottom 0.813: C1.2 21.11,87.61 v21,87.5
X_DIR  (via drill 0.35)
  Top 0.254: U5.118 46.85,84.45 45.6,85.7 43.4,85.7 v42.6,86.5
  Bottom 0.254: v42.6,86.5 J4.P$3
X_LS  (via drill 0.35)
  Top 0.254: U5.164 34.95,55.55 v34.9,55.5 | v33.1,58.8 33.1,89.7 34.4,91 v37.7,91
  Bottom 0.254: v33.1,58.8 33.1,56 33.6,55.5 v34.9,55.5 | v37.7,91 40.04,91 J4.P$2
X_STEP  (via drill 0.35)
  Top 0.254: U5.86 64.75,70.05 67.3,72.6 67.3,81.7 65.6,83.4 53.8,83.4 52.8,84.4 v52.8,86.5
  Bottom 0.254: v52.8,86.5 52.8,88.4 J4.P$11
XCIN
  Top 0.152: 45.55,41.4 X2.P$1
  Top 0.2: 45.55,41.7 45.55,41.4
  Top 0.254: X2.P$1 45.6,41.05 | 49.33,47.61 U5.20 49.35,45.95 47.33,43.92 C19.P$1 46.52,43.92 45.55,42.95 45.55,41.7
XCOUT
  Top 0.2: 48.05,41.5 X2.P$2
  Top 0.254: X2.P$2 47.75,41.4 | U5.21 49.85,44.73 C24.P$1 48.42,43.92 48.05,43.55 48.05,41.5
XTAL1
  Top 0.152: 52,39.7 X1.1
  Top 0.254: 51.6,39.7 X1.1 | 52,39.7 52.82,39.7 53.1,39.98 53.1,43.5 52.38,44.23 C7.P$1 51.27,44.23 50.85,44.65 U5.23
XTAL2
  Top 0.2: 54.3,41.6 X1.3
  Top 0.254: 54.4,41.7 54.3,41.6 54.3,43.48 C14.P$1 53.83,43.58 51.35,46.05 U5.24
Y_DIR  (via drill 0.35)
  Top 0.254: U5.115 48.35,84.15 45.7,86.5 v45.1,86.5
  Bottom 0.254: v45.1,86.5 45.1,88.38 J4.P$5
Y_LS  (via drill 0.35)
  Top 0.254: U5.175 33.45,50.05 v33.4,50 | v32.4,59.5 32.4,89.7 35.5,92.8 v42.6,92.8
  Bottom 0.254: v33.4,50 32.4,51 v32.4,59.5 | v42.6,92.8 J4.P$4
Y_STEP  (via drill 0.35)
  Top 0.254: U5.82 65.65,68.05 67.8,70.2 67.8,82.2 66,84 56.1,84 55.3,84.8 v55.3,86.5
  Bottom 0.254: v55.3,86.5 J4.P$13
Z_DIR  (via drill 0.35)
  Top 0.254: U5.121 45.35,84.45 44.6,85.2 41.4,85.2 v40.1,86.5
  Bottom 0.254: v40.1,86.5 40.1,88.4 J4.P$1
Z_LS  (via drill 0.35)
  Top 0.254: v31.6,60.3 31.6,89.6 35.5,93.5 44.5,93.5 45.15,92.85 v45.15,92.8 | U5.169 31.75,53.05 v31.6,53.2
  Bottom 0.254: v31.6,53.2 v31.6,60.3 | v45.15,92.8 J4.P$6
Z_STEP  (via drill 0.35)
  Top 0.254: U5.92 59.85,82.05 59.1,82.8 53,82.8 50.2,85.6 v50.2,86.5
  Bottom 0.254: v50.2,86.5 50.2,88.4 J4.P$9